# Altium schematic sheet MercurialSDR_MISC.SchDoc: MercurialSDR - Miscellaneous
size A4; Author: Andres Hojnadel; DrawnBy: Andres Hojnadel; Revision: Rev1.1; SheetNumber: 6; SheetTotal: 6; ProjectName: MercurialSDR
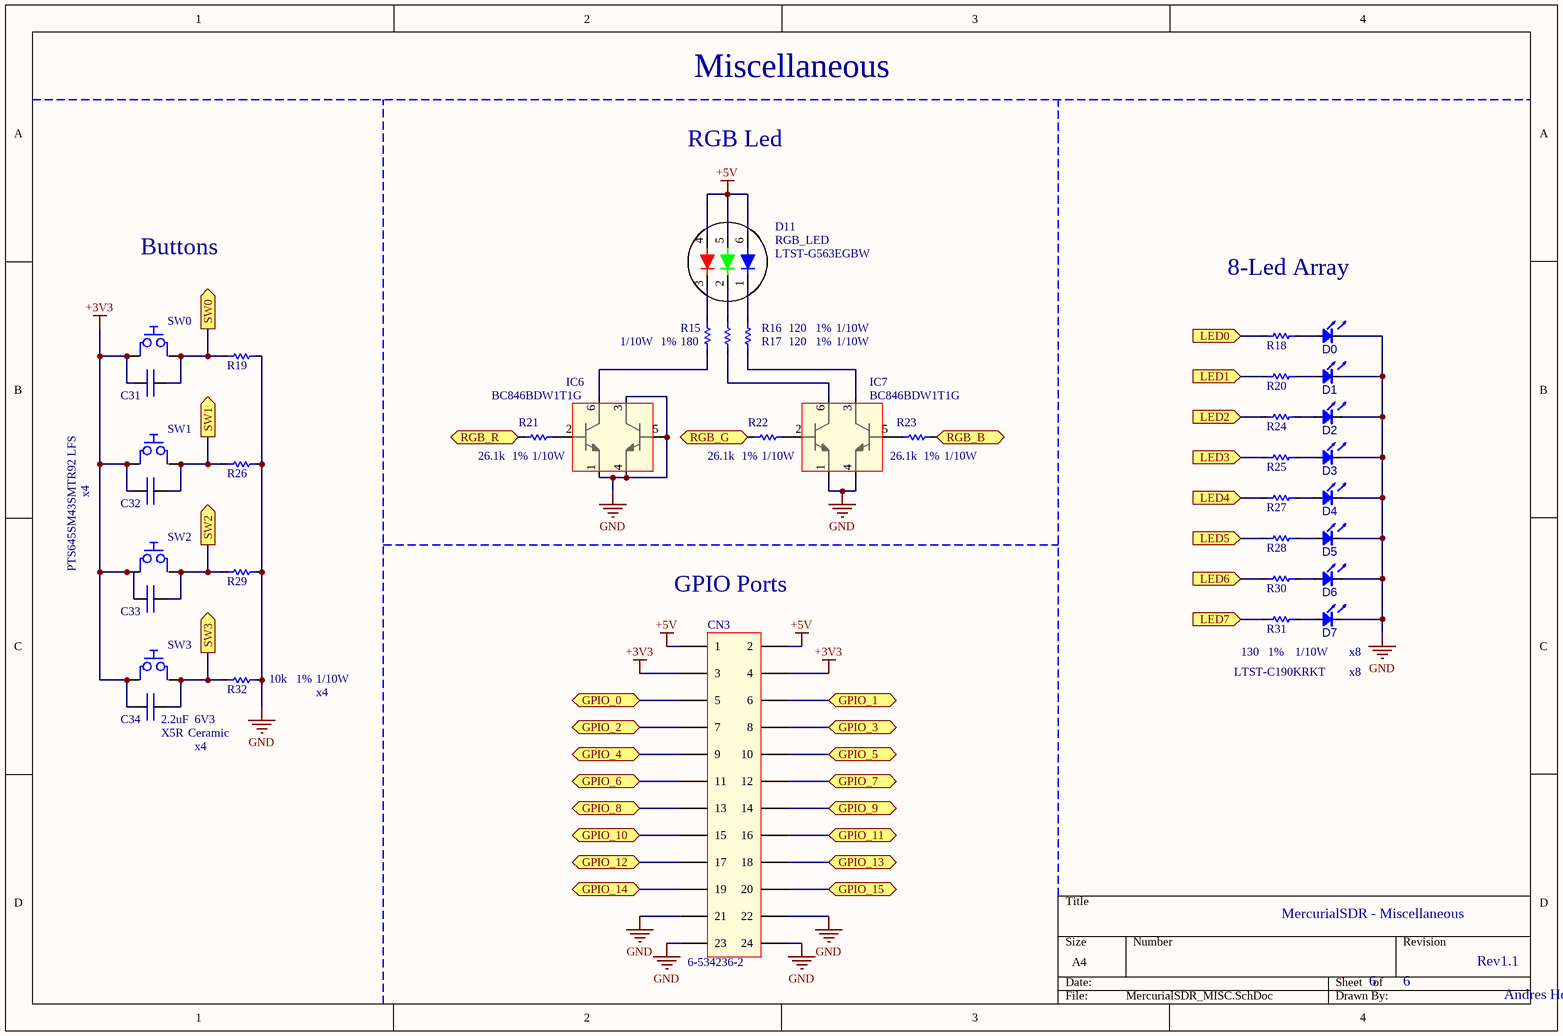
[diagram p0: MercurialSDR_MISC.SchDoc]

## Parts
C31  Capacitor  [CAP_0603]  (value not drawn)
C32  Capacitor  [CAP_0603]  (value not drawn)
C33  Capacitor  [CAP_0603]  (value not drawn)
C34  value 2.2uF  Temp Coef: X5R  VR: 6V3  Material: Ceramic  [CAP_0603]  (hidden comment: Capacitor)
CN3  Part Number: 6-534236-2  [CON_12x2]  (hidden comment: Connector)
D0  Led_small  [LED_0603]  (value not drawn)
D1  Led_small  [LED_0603]  (value not drawn)
D2  Led_small  [LED_0603]  (value not drawn)
D3  Led_small  [LED_0603]  (value not drawn)
D4  Led_small  [LED_0603]  (value not drawn)
D5  Led_small  [LED_0603]  (value not drawn)
D6  Led_small  [LED_0603]  (value not drawn)
D7  Part Number: LTST-C190KRKT  [LED_0603]  (hidden comment: Led_small)
D11  RGB_LED  Part Number: LTST-G563EGBW  [LED_RGB 5x5mm]
IC6  Part Number: BC846BDW1T1G  [TSSOP-6]  (hidden comment: BC846)
IC7  Part Number: BC846BDW1T1G  [TSSOP-6]  (hidden comment: BC846)
R15  value 180  Power: 1/10W  Tolerance: 1%  [RES_0603]  (hidden comment: Resistor SMD)
R16  value 120  Power: 1/10W  Tolerance: 1%  [RES_0603]  (hidden comment: Resistor SMD)
R17  value 120  Power: 1/10W  Tolerance: 1%  [RES_0603]  (hidden comment: Resistor SMD)
R18  Resistor SMD  [RES_0603]  (value not drawn)
R19  value 10k  Power: 1/10W  Tolerance: 1%  [RES_0603]  (hidden comment: Resistor SMD)
R20  Resistor SMD  [RES_0603]  (value not drawn)
R21  value 26.1k  Power: 1/10W  Tolerance: 1%  [RES_0603]  (hidden comment: Resistor SMD)
R22  value 26.1k  Power: 1/10W  Tolerance: 1%  [RES_0603]  (hidden comment: Resistor SMD)
R23  value 26.1k  Power: 1/10W  Tolerance: 1%  [RES_0603]  (hidden comment: Resistor SMD)
R24  Resistor SMD  [RES_0603]  (value not drawn)
R25  Resistor SMD  [RES_0603]  (value not drawn)
R26  Resistor SMD  [RES_0603]  (value not drawn)
R27  Resistor SMD  [RES_0603]  (value not drawn)
R28  Resistor SMD  [RES_0603]  (value not drawn)
R29  Resistor SMD  [RES_0603]  (value not drawn)
R30  Resistor SMD  [RES_0603]  (value not drawn)
R31  value 130  Power: 1/10W  Tolerance: 1%  [RES_0603]  (hidden comment: Resistor SMD)
R32  Resistor SMD  [RES_0603]  (value not drawn)
SW0  Pulsador  [SWITCH_6X6mm]  (value not drawn)
SW1  Pulsador  [SWITCH_6X6mm]  (value not drawn)
SW2  Pulsador  [SWITCH_6X6mm]  (value not drawn)
SW3  Part Number: PTS645SM43SMTR92 LFS  [SWITCH_6X6mm]  (hidden comment: Pulsador)

## Ports
GPIO_0 (bidir), GPIO_1 (bidir), GPIO_2 (bidir), GPIO_3 (bidir), GPIO_4 (bidir), GPIO_5 (bidir), GPIO_6 (bidir), GPIO_7 (bidir), GPIO_8 (bidir), GPIO_9 (bidir), GPIO_10 (bidir), GPIO_11 (bidir), GPIO_12 (bidir), GPIO_13 (bidir), GPIO_14 (bidir), GPIO_15 (bidir), LED0 (in), LED1 (in), LED2 (in), LED3 (in), LED4 (in), LED5 (in), LED6 (in), LED7 (in), RGB_B (in), RGB_G (in), RGB_R (in), SW0 (out), SW1 (out), SW2 (out), SW3 (out)

## Nets
+3V3: C31.1 C32.1 C33.1 C34.1 CN3.3 CN3.4 SW0.1 SW1.1 SW2.1 SW3.1
+5V: CN3.1 CN3.2 D11.4(RA) D11.5(GA) D11.6(BA)
GND: CN3.21 CN3.22 CN3.23 CN3.24 D0.2(K) D1.2(K) D2.2(K) D3.2(K) D4.2(K) D5.2(K) D6.2(K) D7.2(K) IC6.1(E_1) IC6.3(C_2) IC6.4(E_2) IC6.5(B_2) IC7.1(E_1) IC7.4(E_2) R19.1 R26.1 R29.1 R32.1
GPIO_0: CN3.5 ; port GPIO_0
GPIO_1: CN3.6 ; port GPIO_1
GPIO_2: CN3.7 ; port GPIO_2
GPIO_3: CN3.8 ; port GPIO_3
GPIO_4: CN3.9 ; port GPIO_4
GPIO_5: CN3.10 ; port GPIO_5
GPIO_6: CN3.11 ; port GPIO_6
GPIO_7: CN3.12 ; port GPIO_7
GPIO_8: CN3.13 ; port GPIO_8
GPIO_9: CN3.14 ; port GPIO_9
GPIO_10: CN3.15 ; port GPIO_10
GPIO_11: CN3.16 ; port GPIO_11
GPIO_12: CN3.17 ; port GPIO_12
GPIO_13: CN3.18 ; port GPIO_13
GPIO_14: CN3.19 ; port GPIO_14
GPIO_15: CN3.20 ; port GPIO_15
LED0: R18.2 ; port LED0
LED1: R20.2 ; port LED1
LED2: R24.2 ; port LED2
LED3: R25.2 ; port LED3
LED4: R27.2 ; port LED4
LED5: R28.2 ; port LED5
LED6: R30.2 ; port LED6
LED7: R31.2 ; port LED7
RGB_B: R23.1 ; port RGB_B
RGB_G: R22.2 ; port RGB_G
RGB_R: R21.2 ; port RGB_R
SW0: C31.2 R19.2 SW0.4 ; port SW0
SW1: C32.2 R26.2 SW1.4 ; port SW1
SW2: C33.2 R29.2 SW2.4 ; port SW2
SW3: C34.2 R32.2 SW3.4 ; port SW3
NetD0_1: D0.1(A) R18.1
NetD1_1: D1.1(A) R20.1
NetD2_1: D2.1(A) R24.1
NetD3_1: D3.1(A) R25.1
NetD4_1: D4.1(A) R27.1
NetD5_1: D5.1(A) R28.1
NetD6_1: D6.1(A) R30.1
NetD7_1: D7.1(A) R31.1
NetD11_1: D11.1(BK) R17.1
NetD11_2: D11.2(GK) R16.1
NetD11_3: D11.3(RK) R15.1
NetIC6_2: IC6.2(B_1) R21.1
NetIC6_6: IC6.6(C_1) R15.2
NetIC7_2: IC7.2(B_1) R22.1
NetIC7_3: IC7.3(C_2) R17.2
NetIC7_5: IC7.5(B_2) R23.2
NetIC7_6: IC7.6(C_1) R16.2

Not connected (* = marked no-connect by the designer): SW0 2 3; SW1 2 3; SW2 2 3; SW3 2 3

## Notes on the sheet
- Miscellaneous
- RGB Led
- Buttons
- 8-Led Array
- x4
- (near CN3) GPIO Ports
- (near D7) x8
- (near R32) x4
- x8

## Library data of the parts
C31-C33 = Cap: Capacitor no polarizado; Part Number: CL10A225KQ8NNNC; Value: 2.2uF; Temp Coef: X5R; VR: 6V3; Material: Ceramic
C34 = Cap: Capacitor no polarizado; Part Number: CL10A225KQ8NNNC
CN3 = CN_12x2: Conector genérico 12x2
D0-D6 = Led_small: Part Number: LTST-C190KRKT; Color: Red
D7 = Led_small: Color: Red
D11 = LED_RGB: Led RGB
IC6 IC7 = BC846BDW_1: TBJ NPN Dual; Package: TSSOP-6
R15 = Res: Resistor; Part Number: CR0603-FX-1800ELF
R16 R17 = Res: Resistor; Part Number: CR0603-FX-1200ELF
R18 R20 R24 R25 R27 R28 R30 = Res: Resistor; Part Number: CR0603-FX-1300ELF; Value: 130; Power: 1/10W; Tolerance: 1%
R19 = Res: Resistor; Part Number: CR0603-FX-1002EAS
R21-R23 = Res: Resistor; Part Number: CR0603-FX-2612ELF
R26 R29 R32 = Res: Resistor; Part Number: CR0603-FX-1002EAS; Value: 10k; Power: 1/10W; Tolerance: 1%
R31 = Res: Resistor; Part Number: CR0603-FX-1300ELF
SW0-SW2 = Pulsador: Part Number: PTS645SM43SMTR92 LFS